# Altium schematic sheet 0402WGF4702TCE1_0402WGF4702TCE.schdoc
size 127 x 99 mm
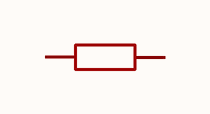
[diagram p0: 0402WGF4702TCE1_0402WGF4702TCE.schdoc]

## Parts
R?  47kΩ  [R0402]  (value not drawn)

## Nets

Not connected (* = marked no-connect by the designer): R? 1 2

## Library data of the parts
R? = 0402WGF4702TCE: Manufacturer: UNI-ROYAL(厚声); Add into BOM: yes; Tolerance: ±1%; Power(Watts): 62.5mW; Voltage-Supply(Max): 50V; Temperature Coefficient: ±100ppm/℃; Symbol: 0402WGF4702TCE; Device: 0402WGF4702TCE; LCSC Part Name: 47kΩ ±1% 62.5mW 厚膜电阻; Supplier Part: C25792; Manufacturer Part: 0402WGF4702TCE; Supplier Footprint: 0402; JLCPCB Part Class: Basic Part; Datasheet: https://item.szlcsc.com/datasheet/0402WGF4702TCE/26535.html; Supplier: LCSC; Convert to PCB: yes; Type: 厚膜电阻; Value: 47kΩ; Operating Temperature: -55℃~+155℃